# Altium schematic sheet POWER.SchDoc: POWER
size A4; DocumentNumber: 10; Revision: 1.9; SheetNumber: 10; SheetTotal: 18
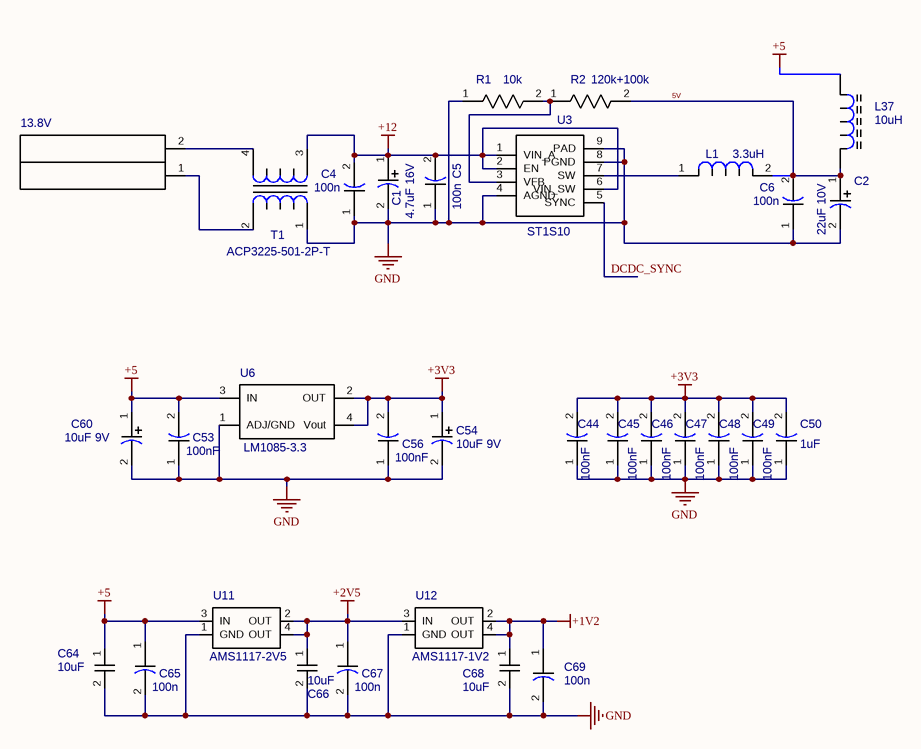
[diagram p0: POWER.SchDoc]

## Parts
13.8V  JX2  [JX2]  (value not drawn)
C1  4.7uF 16V  [CAPAE_6.6x6.6h5.4]
C2  22uF 10V  [CAPAE_4.3x4.3h5.4]
C4  100n  [CAP_0805]
C5  100n  [CAP_0805]
C6  100n  [CAP_0805]
C44  100nF  [CAP_0805]
C45  100nF  [CAP_0805]
C46  100nF  [CAP_0805]
C47  100nF  [CAP_0805]
C48  100nF  [CAP_0805]
C49  100nF  [CAP_0805]
C50  value 1uF  [CAP_0805]  (hidden comment: 10uF)
C53  100nF  [CAP_0805]
C54  10uF 9V  [CAPAE_4.3x4.3h5.4]
C56  100nF  [CAP_0805]
C60  10uF 9V  [CAPAE_4.3x4.3h5.4]
C64  10uF  [C0805]
C65  100n  [CAP_0805]
C66  10uF  [C0805]
C67  100n  [CAP_0805]
C68  10uF  [C0805]
C69  100n  [CAP_0805]
L1  3.3uH  [IND_1812]
L37  10uH  [IND_FERRITE_CORE]
R1  10k  [RES_0805]
R2  120k+100k  [RES_0805]
T1  ACP3225-501-2P-T  [TRANSF_ICORE]
U3  ST1S10  [ST1S10]
U6  LM1085-3.3  [LM1085-3.3]
U11  AMS1117-2V5  [AMS1117]
U12  AMS1117-1V2  [AMS1117]

## Nets
+1V2: C68.1 C69.1 U12.2(OUT) U12.4(OUT)
+2V5: C66.1 C67.1 U11.2(OUT) U11.4(OUT) U12.3(IN)
+3V3: C44.2 C45.2 C46.2 C47.2 C48.2 C49.2 C50.2 C54.1(PLUS) C56.2 U6.2(OUT) U6.4(Vout)
+5: C53.2 C60.1(PLUS) C64.1 C65.1 L37.1(A) U6.3(IN) U11.3(IN)
+12: C1.1(PLUS) C4.2 C5.2 T1.3(P1) U3.1(VIN_A) U3.2(EN) U3.6(VIN_SW)
GND: C1.2(MINUS) C2.2(MINUS) C4.1 C5.1 C6.1 C44.1 C45.1 C46.1 C47.1 C48.1 C49.1 C50.1 C53.1 C54.2(MINUS) C56.1 C60.2(MINUS) C64.2 C65.2 C66.2 C67.2 C68.2 C69.2 R1.1 T1.1(S1) U3.4(AGND) U3.8(PGND) U3.9(PAD) U6.1(ADJ/GND) U11.1(GND) U12.1(GND)
5V: C2.1(PLUS) C6.2 L1.2 L37.2(B) R2.2
DCDC_SYNC: U3.5(SYNC)
Net13.8V_1: 13.8V.1 T1.2(S2)
Net13.8V_2: 13.8V.2 T1.4(P2)
NetL1_1: L1.1 U3.7(SW)
NetR1_2: R1.2 R2.1 U3.3(VFB)

## Notes on the sheet
- Title
- Size:
- Date:
- A4
- Number:
- Time:
- Revision:
- Sheet
- of
- File:

## Library data of the parts
C1 = CAPAE_6.6x6.6h5.4: Value: 4.7uF 16V
C2 C54 C60 = CAPAE_4.3x4.3h5.4
  C2: Value: 22uF 10V
  C54 C60: Value: 10uF 9V
C4-C6 C44-C50 C53 C56 C65 C67 C69 = CAP_0805
  C4-C6 C65 C67 C69: Value: 100n
  C44-C49 C53 C56: Value: 100nF
C64 C66 C68 = C0805: Value: 10uF
L1 = IND_1812: Value: 3.3uH
L37 = IND_FERRITE_CORE: Inductor; Value: 10uH
R1 R2 = RES_0805
  R1: Value: 10k
  R2: Value: 120k+100k
T1 = TRANSF_ICORE: Transformer; Value: ACP3225-501-2P-T
U11 U12 = AMS1117
  U11: Value: AMS1117-2V5
  U12: Value: AMS1117-1V2
U3 = ST1S10: Value: ST1S10
U6 = LM1085-3.3: Value: LM1085-3.3